# EAGLE design RAMPS_1-2c (EAGLE 5.11)
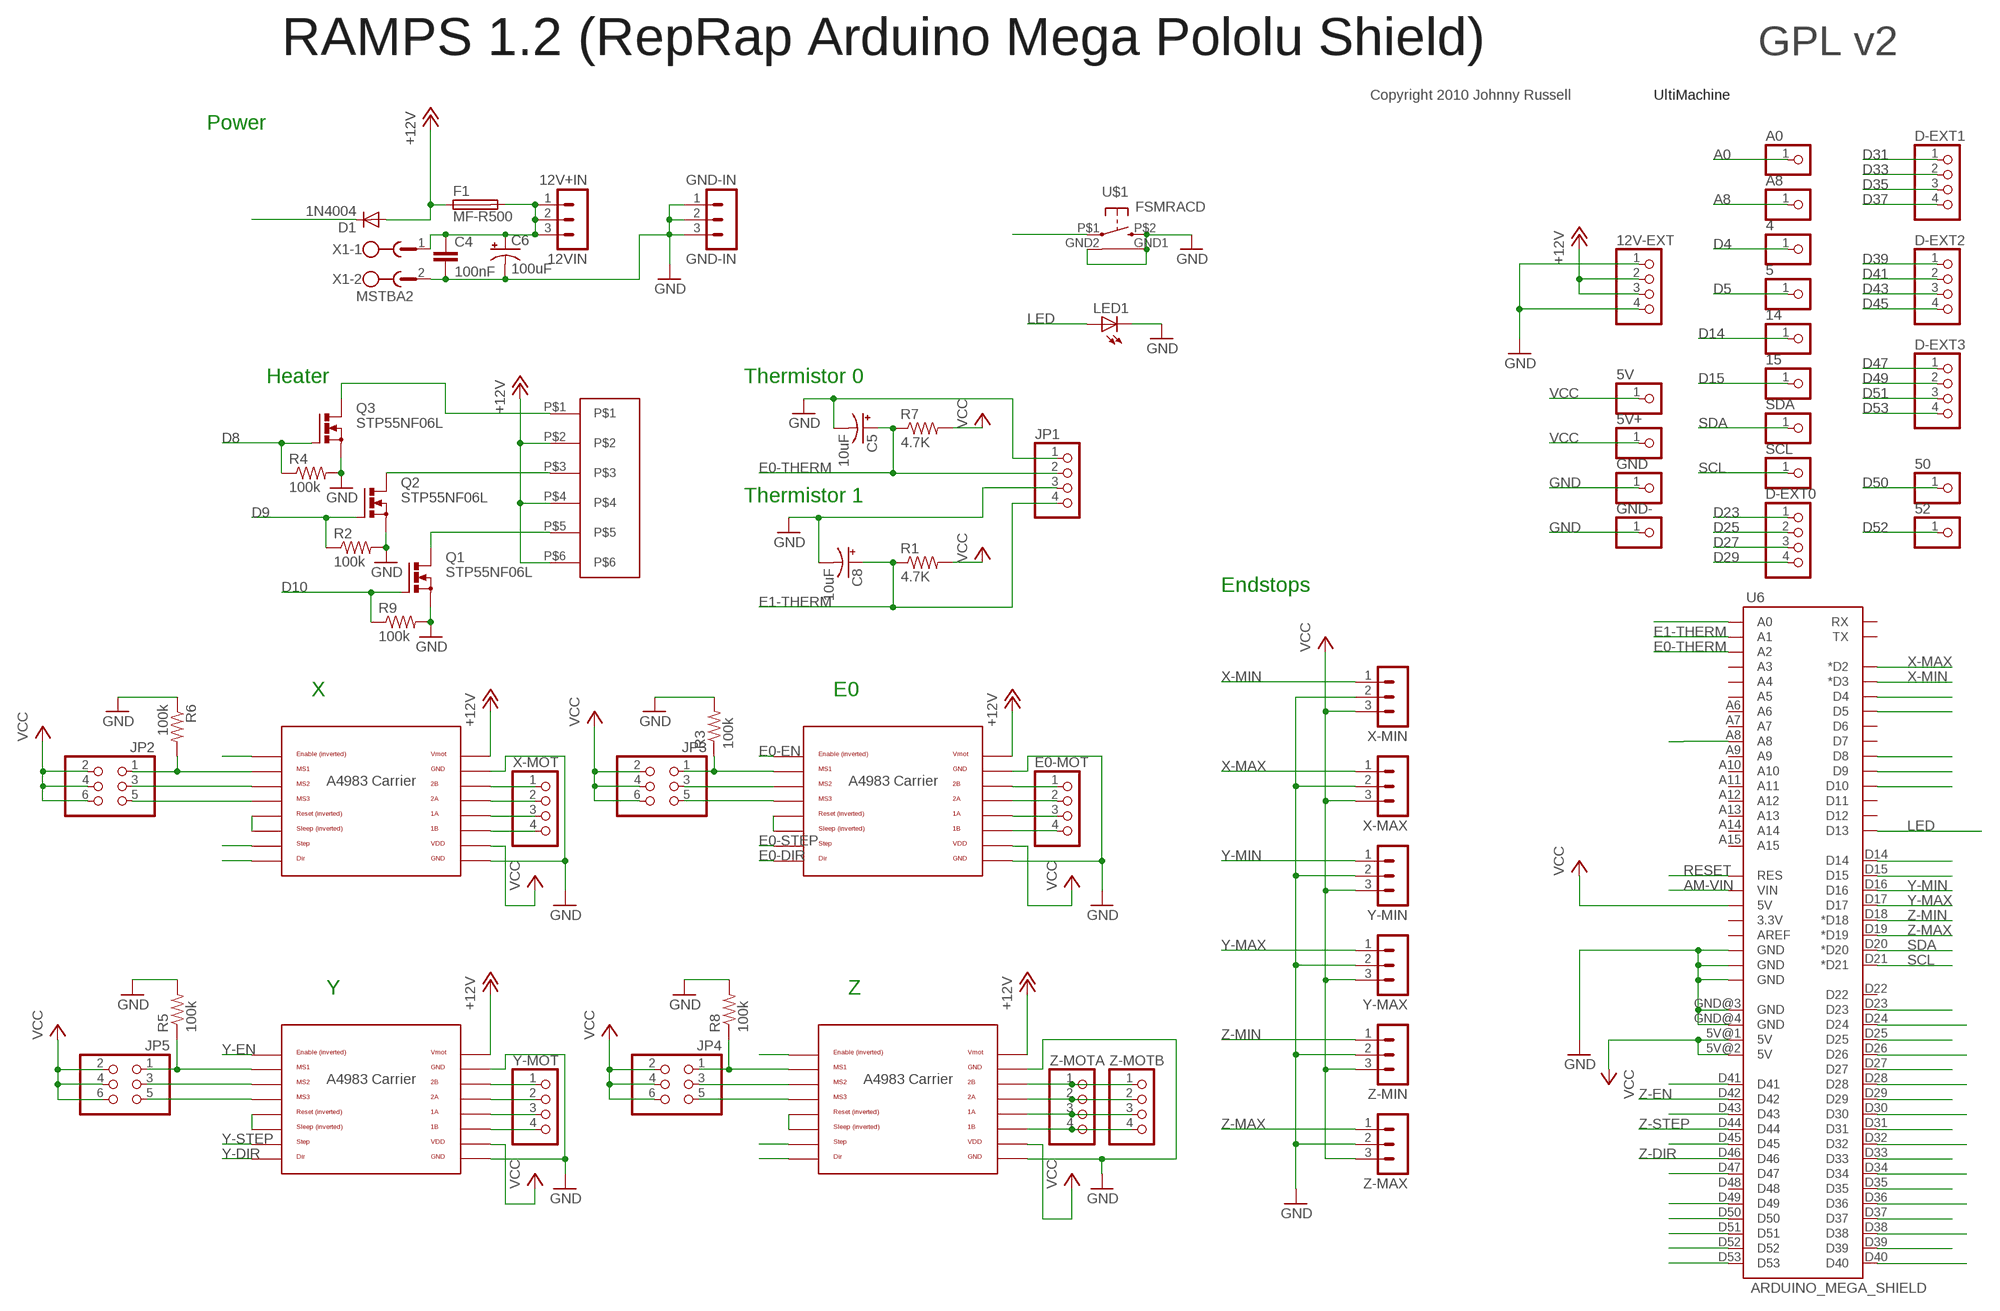
[diagram p0: schematic, sheet 1]

## Parts
4  PINHD-1X1  [1X01]
5  PINHD-1X1  [1X01]
5V  PINHD-1X1  [1X01]
5V+  PINHD-1X1  [1X01]
12V-EXT  PINHD-1X4  [1X04]
12VIN  12V+IN  3PIN-HEADER  [3PIN-HEADER]
14  PINHD-1X1  [1X01]
15  PINHD-1X1  [1X01]
50  PINHD-1X1  [1X01]
52  PINHD-1X1  [1X01]
A0  PINHD-1X1  [1X01]
A8  PINHD-1X1  [1X01]
C4  100nF  C2,5-3  [C2.5-3]
C5  10uF  CPOL-USE2.5-5  [E2,5-5]
C6  100uF  CPOL-USE2.5-5  [E2,5-5]
C8  10uF  CPOL-USE2.5-5  [E2,5-5]
D1  1N4004  [DO41-10]
D-EXT0  PINHD-1X4  [1X04]
D-EXT1  PINHD-1X4  [1X04]
D-EXT2  PINHD-1X4  [1X04]
D-EXT3  PINHD-1X4  [1X04]
E0-MOT  PINHD-1X4  [1X04]
F1  MF-R500  LITTLEFUSE  [LITTLEFUSE]
GND  PINHD-1X1  [1X01]
GND-  PINHD-1X1  [1X01]
GND-IN  GND-IN  3PIN-HEADER  [3PIN-HEADER]
JP1  PINHD-1X4  [1X04]
JP2  PINHD-2X3  [2X03]
JP3  PINHD-2X3  [2X03]
JP4  PINHD-2X3  [2X03]
JP5  PINHD-2X3  [2X03]
LED1  LED3MM  [LED3MM]
Q1  STP55NF06L  IRF512  [TO220BV]
Q2  STP55NF06L  IRF512  [TO220BV]
Q3  STP55NF06L  IRF512  [TO220BV]
R1  4.7K  R-US_0207/7  [0207/7]
R2  100k  R-US_0207/7  [0207/7]
R3  100k  R-US_0207/7  [0207/7]
R4  100k  R-US_0207/7  [0207/7]
R5  100k  R-US_0207/7  [0207/7]
R6  100k  R-US_0411/3V  [0411V]
R7  4.7K  R-US_0207/7  [0207/7]
R8  100k  R-US_0207/7  [0207/7]
R9  100k  R-US_0207/7  [0207/7]
SCL  PINHD-1X1  [1X01]
SDA  PINHD-1X1  [1X01]
U2  POLOLU_A4983CARRIER  [A4983CARRIER]
U3  POLOLU_A4983CARRIER  [A4983CARRIER]
U4  POLOLU_A4983CARRIER  [A4983CARRIER]
U5  POLOLU_A4983CARRIER  [A4983CARRIER]
U6  ARDUINO_MEGA_SHIELD  [ARDUINO_MEGA_SHIELD]
U$1  FSMRACD  [FSMRACD]
U$2  282837-6  [282837-6]
X1  MSTBA2  [MSTBA2]
X-MAX  3PIN-HEADER  [3PIN-HEADER]
X-MIN  3PIN-HEADER  [3PIN-HEADER]
X-MOT  PINHD-1X4  [1X04]
Y-MAX  3PIN-HEADER  [3PIN-HEADER]
Y-MIN  3PIN-HEADER  [3PIN-HEADER]
Y-MOT  PINHD-1X4  [1X04]
Z-MAX  3PIN-HEADER  [3PIN-HEADER]
Z-MIN  3PIN-HEADER  [3PIN-HEADER]
Z-MOTA  PINHD-1X4  [1X04]
Z-MOTB  PINHD-1X4  [1X04]

## Nets
+12V: 12V-EXT.2 12V-EXT.3 D1.A F1.1 U2.VMOT U3.VMOT U4.VMOT U5.VMOT U$2.P$2 U$2.P$4 U$2.P$6
A0: A0.1 U6.A0
A8: A8.1 U6.A8
AM-VIN: D1.C U6.VIN
D4: 4.1 U6.D4
D5: 5.1 U6.D5
D8: Q3.G R4.1 U6.D8
D9: Q2.G R2.1 U6.D9
D10: Q1.G R9.1 U6.D10
D14: 14.1 U6.D14
D15: 15.1 U6.D15
D23: D-EXT0.1 U6.D23
D25: D-EXT0.2 U6.D25
D27: D-EXT0.3 U6.D27
D29: D-EXT0.4 U6.D29
D31: D-EXT1.1 U6.D31
D33: D-EXT1.2 U6.D33
D35: D-EXT1.3 U6.D35
D37: D-EXT1.4 U6.D37
D39: D-EXT2.1 U6.D39
D41: D-EXT2.2 U6.D41
D43: D-EXT2.3 U6.D43
D45: D-EXT2.4 U6.D45
D47: D-EXT3.1 U6.D47
D49: D-EXT3.2 U6.D49
D50: 50.1 U6.D50
D51: D-EXT3.3 U6.D51
D52: 52.1 U6.D52
D53: D-EXT3.4 U6.D53
E0-DIR: U5.DIR U6.D34
E0-EN: U5.EN U6.D30
E0-STEP: U5.STEP U6.D32
E0-THERM: C5.+ JP1.2 R7.1 U6.A2
E1-THERM: C8.+ JP1.4 R1.1 U6.A1
GND: 12V-EXT.1 12V-EXT.4 C4.2 C5.- C6.- C8.- GND-.1 GND-IN.1 GND-IN.2 GND-IN.3 GND.1 JP1.1 JP1.3 LED1.K(C) Q1.S Q2.S Q3.S R2.2 R3.2 R4.2 R5.2 R6.1 R8.2 R9.2 U2.GND U2.GND@0(GND) U3.GND U3.GND@0(GND) U4.GND U4.GND@0(GND) U5.GND U5.GND@0(GND) U6.GND@0(GND) U6.GND@1(GND) U6.GND@2(GND) U6.GND@3(GND) U6.GND@4(GND) U$1.GND1 U$1.GND2 U$1.P$2(S) X1.2 X-MAX.2 X-MIN.2 Y-MAX.2 Y-MIN.2 Z-MAX.2 Z-MIN.2
LED: LED1.A U6.D13
N$1: Q1.D U$2.P$5
N$2: Q2.D U$2.P$3
N$3: U2.2B X-MOT.1
N$4: U2.2A X-MOT.2
N$5: JP2.1 R6.2 U2.MS1
N$6: JP2.3 U2.MS2
N$7: Q3.D U$2.P$1
N$8: U2.RST U2.SLP(SLEEP)
N$9: JP2.5 U2.MS3
N$10: U2.1A X-MOT.3
N$11: U2.1B X-MOT.4
N$12: U5.RST U5.SLP(SLEEP)
N$13: JP3.5 U5.MS3
N$14: JP4.1 R8.1 U4.MS1
N$15: JP5.1 R5.1 U3.MS1
N$16: JP3.3 U5.MS2
N$17: JP4.3 U4.MS2
N$18: JP3.1 R3.1 U5.MS1
N$19: JP5.3 U3.MS2
N$20: JP5.5 U3.MS3
N$21: U3.RST U3.SLP(SLEEP)
N$22: U3.2B Y-MOT.1
N$23: JP4.5 U4.MS3
N$24: E0-MOT.1 U5.2B
N$25: E0-MOT.2 U5.2A
N$26: U3.2A Y-MOT.2
N$27: U3.1A Y-MOT.3
N$28: U4.2B Z-MOTA.1 Z-MOTB.1
N$29: U4.2A Z-MOTA.2 Z-MOTB.2
N$30: U4.1A Z-MOTA.3 Z-MOTB.3
N$31: U4.RST U4.SLP(SLEEP)
N$32: E0-MOT.3 U5.1A
N$33: U4.1B Z-MOTA.4 Z-MOTB.4
N$34: E0-MOT.4 U5.1B
N$35: U3.1B Y-MOT.4
N$37: 12VIN.1 12VIN.2 12VIN.3 C4.1 C6.+ F1.2 X1.1
RESET: U6.RES U$1.P$1(P)
SCL: SCL.1 U6.D21(*D21)
SDA: SDA.1 U6.D20(*D20)
VCC: 5V+.1 5V.1 JP2.2 JP2.4 JP2.6 JP3.2 JP3.4 JP3.6 JP4.2 JP4.4 JP4.6 JP5.2 JP5.4 JP5.6 R1.2 R7.2 U2.VDD U3.VDD U4.VDD U5.VDD U6.5V@0(5V) U6.5V@1(5V) U6.5V@2(5V) X-MAX.3 X-MIN.3 Y-MAX.3 Y-MIN.3 Z-MAX.3 Z-MIN.3
X-DIR: U2.DIR U6.D28
X-EN: U2.EN U6.D24
X-MAX: U6.D2(*D2) X-MAX.1
X-MIN: U6.D3(*D3) X-MIN.1
X-STEP: U2.STEP U6.D26
Y-DIR: U3.DIR U6.D40
Y-EN: U3.EN U6.D36
Y-MAX: U6.D17 Y-MAX.1
Y-MIN: U6.D16 Y-MIN.1
Y-STEP: U3.STEP U6.D38
Z-DIR: U4.DIR U6.D46
Z-EN: U4.EN U6.D42
Z-MAX: U6.D19(*D19) Z-MAX.1
Z-MIN: U6.D18(*D18) Z-MIN.1
Z-STEP: U4.STEP U6.D44
Unconnected: U6.3.3V U6.A3 U6.A4 U6.A5 U6.A6 U6.A7 U6.A9 U6.A10 U6.A11 U6.A12 U6.A13 U6.A14 U6.A15 U6.AREF U6.D6 U6.D7 U6.D11 U6.D12 U6.D22 U6.D48 U6.RX U6.TX

## Notes on the sheet
- RAMPS 1.2 (RepRap Arduino Mega Pololu Shield) | GPL v2
- Copyright 2010 Johnny Russell | UltiMachine
- Power
- Heater | Thermistor 0
- Thermistor 1
- Endstops
- X | E0
- Y | Z

## Library data of the parts
4 5 5V 5V+ 14 15 50 52 A0 A8 GND GND- SCL SDA = adafruit:PINHD-1X1: Pin header 1x1 for 0.1" spacing With round pins
12V-EXT D-EXT0 D-EXT1-D-EXT3 E0-MOT JP1 X-MOT Y-MOT Z-MOTA Z-MOTB = RepRapjr:PINHD-1X4: PIN HEADER
12VIN GND-IN X-MAX X-MIN Y-MAX Y-MIN Z-MAX Z-MIN = ultimachine:3PIN-HEADER: PIN HEADER
C4 = capacitor-wima:C: CAPACITOR naming: grid - package width
C5 C6 C8 = adafruit:CPOL-US: POLARIZED CAPACITOR, American symbol
D1 = diode:1N4004: DIODE general purpose rectifier, 1 A
F1 = fuse:LITTLEFUSE: LITTLEFUSE Picofuse/slow Littlefuse
JP2-JP5 = pinhead:PINHD-2X3: PIN HEADER
LED1 = led:LED: LED OSRAM: - CHIPLED LG R971, LG N971, LY N971, LG Q971, LY Q971, LO R971, LY R971 LH N974, LH R974 LS Q976, LO Q976, LY Q976 LO Q996 - Hyper CHIPLED LW Q18S LB Q993, LB Q99A, LB R99A - SideLED LS A670, LO A670, LY A670, LG A670, LP A670 LB A673, LV A673, LT A673, LW A673 LH A674 LY A675 LS A676, LA A676, LO A676, LY A676, LW A676 LS A679, LY A679, LG A679 - Hyper Micro SIDELED® LS Y876, LA Y876, LO Y876, LY Y876 LT Y87S - SmartLED LW L88C, LW L88S LB L89C, LB L89S, LG L890 LS L89K, LO L89K, LY L89K LS L896, LA L896, LO L896, LY L896 - TOPLED LS T670, LO T670, LY T670, LG T670, LP T670 LSG T670, LSP T670, LSY T670, LOP T670, LYG T670 LG T671, LOG T671, LSG T671 LB T673, LV T673, LT T673, LW T673 LH T674 LS T676, LA T676, LO T676, LY T676, LB T676, LH T676, LSB T676, LW T676 LB T67C, LV T67C, LT T67C, LS T67K, LO T67K, LY T67K, LW E67C LS E67B, LA E67B, LO E67B, LY E67B, LB E67C, LV E67C, LT E67C LW T67C LS T679, LY T679, LG T679 LS T770, LO T770, LY T770, LG T770, LP T770 LB T773, LV T773, LT T773, LW T773 LH T774 LS E675, LA E675, LY E675, LS T675 LS T776, LA T776, LO T776, LY T776, LB T776 LHGB T686 LT T68C, LB T68C - Hyper Mini TOPLED® LB M676 - Mini TOPLED Santana® LG M470 LS M47K, LO M47K, LY M47K Source: http://www.osram.convergy.de LUXEON: - LUMILED® LXK2-PW12-R00, LXK2-PW12-S00, LXK2-PW14-U00, LXK2-PW14-V00 LXK2-PM12-R00, LXK2-PM12-S00, LXK2-PM14-U00 LXK2-PE12-Q00, LXK2-PE12-R00, LXK2-PE12-S00, LXK2-PE14-T00, LXK2-PE14-U00 LXK2-PB12-K00, LXK2-PB12-L00, LXK2-PB12-M00, LXK2-PB14-N00, LXK2-PB14-P00, LXK2-PB14-Q00 LXK2-PR12-L00, LXK2-PR12-M00, LXK2-PR14-Q00, LXK2-PR14-R00 LXK2-PD12-Q00, LXK2-PD12-R00, LXK2-PD12-S00 LXK2-PH12-R00, LXK2-PH12-S00 LXK2-PL12-P00, LXK2-PL12-Q00, LXK2-PL12-R00 Source: www.luxeon.com KINGBRIGHT: KA-3528ASYC Source: www.kingbright.com
Q1-Q3 = transistor-power:IRF512: N-CHANNEL MOS FET
R1-R9 = adafruit:R-US_: RESISTOR, American symbol
U2-U5 = ultimachine:POLOLU_A4983CARRIER
U6 = RepRapjr:ARDUINO_MEGA_SHIELD
U$1 = RepRapjr:FSMRACD
U$2 = RepRapjr:282837-6
X1 = con-phoenix-508:MSTBA2: PHOENIX

## Board
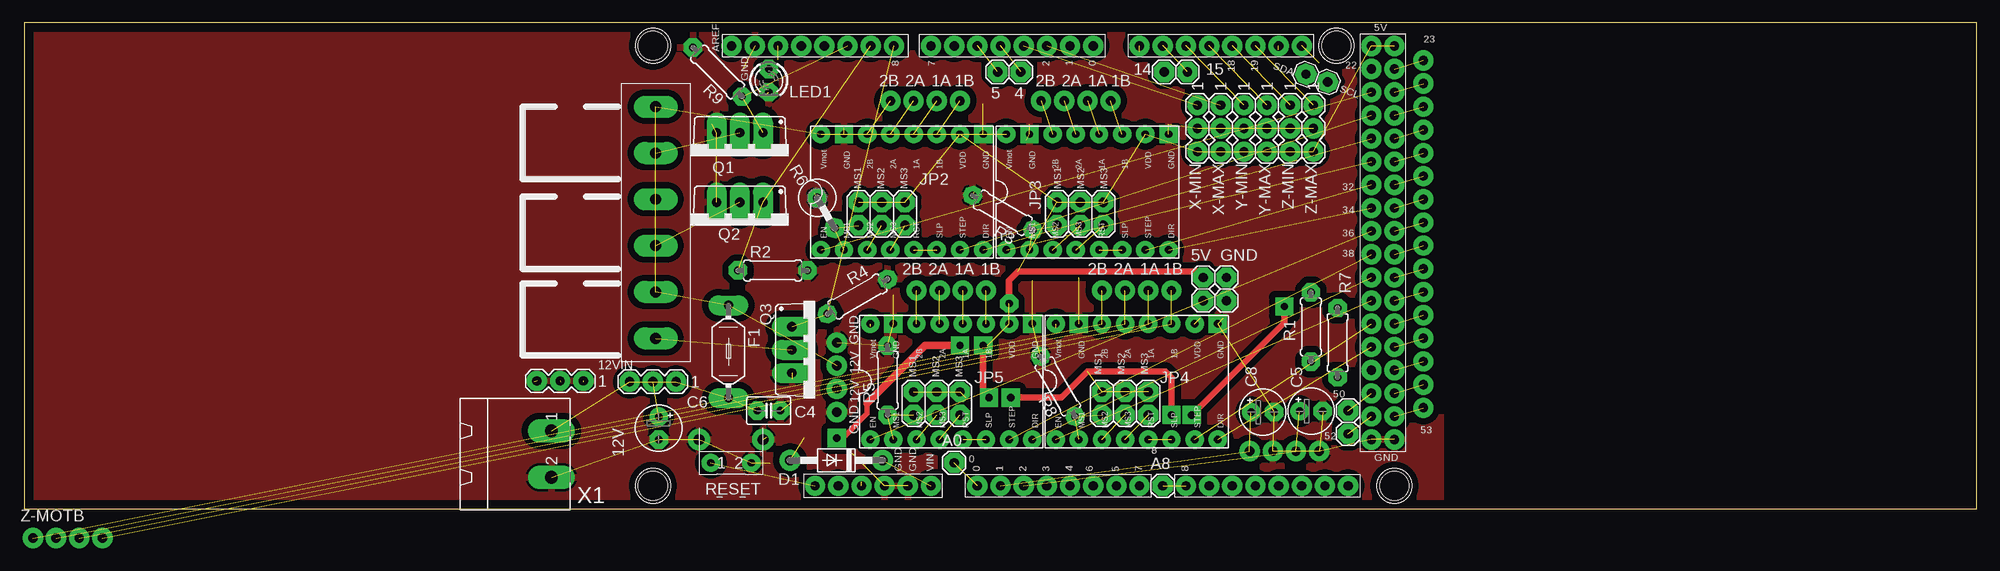
[diagram p1: board, top side]
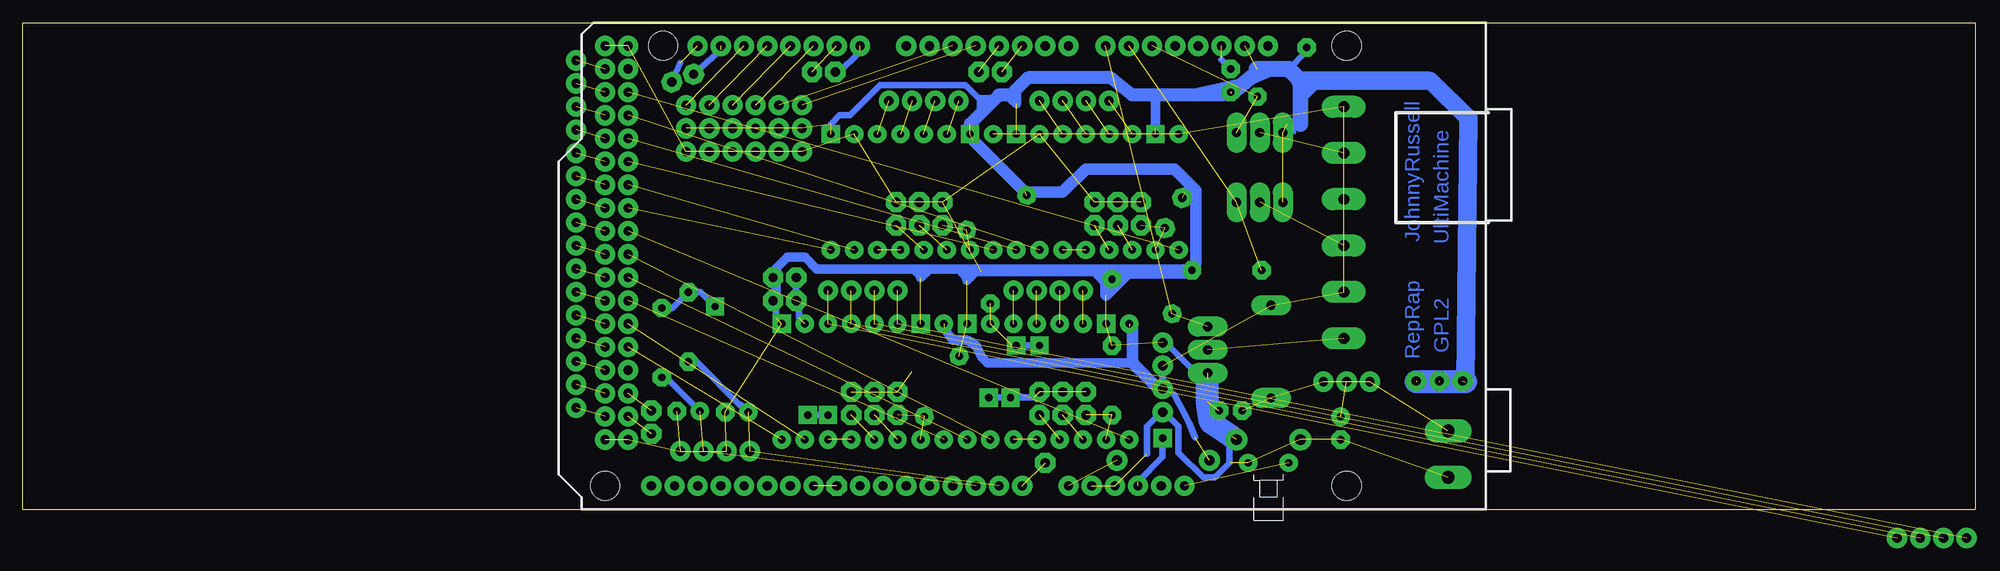
[diagram p2: board, bottom side, seen from below]

Size 213.98 x 53.33 mm. Coordinates in mm from the lower left corner, seen from the top.
Outline: 213.98,0 213.98,53.33 0,53.33 0,0 213.98,0
Copper layers (1*16): Top 0.035mm / dielectric 1.5mm / Bottom 0.035mm
Design rules "reprapprintable": minimum track width 0.7mm, minimum drill 0.8mm, track to track 0.7mm, track to pad 0.32mm, pad to pad 0.32mm, via to via 0.45mm, smd to smd 8mil, copper to edge 40mil, drill to drill 8mil, minimum pad ring 0.6mm, minimum via ring 0.6mm, stop-mask expansion 4mil, vias tented up to drill 0mil, thermal gap 10mil

### Footprints (pad centres in the part's own frame; a part is rotated, then mirrored left to right if it is on the bottom)
1X01 = drill 1.016 pad 1.93 octagon: 1 0,0
1X04 = drill 1.016 round: 1 -2.54,0; 2 0,0; 3 2.54,0; 4 5.08,0
3PIN-HEADER = drill 1.016 round: 1 -2.54,0; 2 0,0; 3 2.54,0
C2.5-3 = drill 0.813 pad 1.6 octagon: 1 -1.27,0; 2 1.27,0
E2,5-5 = drill 0.813 pad 1.6 round: + -1.27,0 | drill 0.813 pad 1.6 octagon: - 1.27,0
DO41-10 = drill 1.118 round: A 5.08,0; C -5.08,0
LITTLEFUSE = drill 1 pad 1.778 long: 1 -5.08,0; 2 5.08,0
2X03 = drill 1.016 octagon: 1 -2.54,-1.27; 2 -2.54,1.27; 3 0,-1.27; 4 0,1.27; 5 2.54,-1.27; 6 2.54,1.27
LED3MM = drill 0.813 octagon: A -1.27,0; K 1.27,0
TO220BV = drill 1.016 long: D 0,-2.54; G -2.54,-2.54; S 2.54,-2.54
0207/7 = drill 0.813 octagon: 1 -3.81,0; 2 3.81,0
0411V = drill 0.914 octagon: 1 -2.54,0; 2 1.27,0
A4983CARRIER = drill 0.813 round: 1A 8.89,1.27; 1B 11.43,1.27; 2A 6.35,1.27; 2B 3.81,1.27; DIR 16.51,-11.43; EN -1.27,-11.43; MS1 1.27,-11.43; MS2 3.81,-11.43; MS3 6.35,-11.43; RST 8.89,-11.43; SLP 11.43,-11.43; STEP 13.97,-11.43; VDD 13.97,1.27; VMOT -1.27,1.27 | drill 0.813 square: GND 16.51,1.27; GND@0 1.27,1.27
ARDUINO_MEGA_SHIELD = drill 1.016 pad 1.88 round: 3.3V 50.8,26.67; 5V@0 50.8,29.21; 5V@1 2.54,85.09; 5V@2 2.54,87.63; A0 50.8,41.91; A1 50.8,44.45; A2 50.8,46.99; A3 50.8,49.53; A4 50.8,52.07; A5 50.8,54.61; A6 50.8,57.15; A7 50.8,59.69; A8 50.8,64.77; A9 50.8,67.31; A10 50.8,69.85; A11 50.8,72.39; A12 50.8,74.93; A13 50.8,77.47; A14 50.8,80.01; A15 50.8,82.55; AREF 2.54,14.986; D2 2.54,49.53; D3 2.54,46.99; D4 2.54,44.45; D5 2.54,41.91; D6 2.54,39.37; D7 2.54,36.83; D8 2.54,32.766; D9 2.54,30.226; D10 2.54,27.686; D11 2.54,25.146; D12 2.54,22.606; D13 2.54,20.066; D14 2.54,59.69; D15 2.54,62.23; D16 2.54,64.77; D17 2.54,67.31; D18 2.54,69.85; D19 2.54,72.39; D20 2.54,74.93; D21 2.54,77.47; D22 5.08,85.09; D23 5.08,87.63; D24 7.62,85.09; D25 7.62,87.63; D26 10.16,85.09; D27 10.16,87.63; D28 12.7,85.09; D29 12.7,87.63; D30 15.24,85.09; D31 15.24,87.63; D32 17.78,85.09; D33 17.78,87.63; D34 20.32,85.09; D35 20.32,87.63; D36 22.86,85.09; D37 22.86,87.63; D38 25.4,85.09; D39 25.4,87.63; D40 27.94,85.09; D41 27.94,87.63; D42 30.48,85.09; D43 30.48,87.63; D44 33.02,85.09; D45 33.02,87.63; D46 35.56,85.09; D47 35.56,87.63; D48 38.1,85.09; D49 38.1,87.63; D50 40.64,85.09; D51 40.64,87.63; D52 43.18,85.09; D53 43.18,87.63; GND@0 50.8,31.75; GND@1 50.8,34.29; GND@2 2.54,17.526; GND@3 45.72,85.09; GND@4 45.72,87.63; RES 50.8,24.13; RX 2.54,54.61; TX 2.54,52.07; VIN 50.8,36.83 | hole 3.2: 2.54,6.35; 2.54,81.28; 50.8,87.63; 50.8,6.35
FSMRACD = drill 1.2 round: GND1 0,3.81; GND2 6.985,3.81 | drill 0.8 round: P$1 1.27,1.27; P$2 5.715,1.27
282837-6 = drill 1.2 long: P$1 0,-12.7; P$2 0,-7.62; P$3 0,-2.54; P$4 0,2.54; P$5 0,7.62; P$6 0,12.7
MSTBA2 = drill 1.397 long: 1 -2.54,5.08; 2 2.54,5.08

### Placement (x,y rotation side)
4  109.22,47.94 0 top
5  106.68,47.94 0 top
5V  129.22,25.4 0 top
5V+  129.22,22.86 0 top
12V-EXT  89.06,13.18 90 top
12VIN  68.9,13.97 180 top
14  124.94,47.94 0 top
15  127.48,47.94 0 top
50  145.1,10.79 0 top
52  145.1,8.26 0 top
A0  101.92,5.08 0 top
A8  124.78,2.54 0 top
C4  81.6,10.79 0 top
C5  141.05,10.74 0 top
C6  69.53,8.89 270 top
C8  135.73,10.64 0 top
D1  89,5.36 180 top
D-EXT0  153.35,46.67 270 top
D-EXT1  153.35,36.51 270 top
D-EXT2  153.35,26.35 270 top
D-EXT3  153.35,16.19 270 top
E0-MOT  113.98,44.77 0 top
F1  77.18,17.27 270 top
GND  131.76,25.4 0 top
GND-  131.76,22.86 0 top
GND-IN  58.73,14.05 180 top
JP1  139.38,6.35 180 top
JP2  93.98,32.38 0 top
JP3  115.73,32.38 0 top
JP4  120.65,11.59 0 top
JP5  100.01,11.59 0 top
LED1  81.6,46.99 270 top
Q1  78.42,38.73 180 top
Q2  78.42,31.11 180 top
Q3  86.68,17.46 270 top
R1  141.02,19.99 90 top
R2  82.03,26.18 0 top
R3  107.24,32.5 150 top
R4  91.32,23.32 30 top
R5  94.62,14.13 90 top
R6  88.18,31.92 300 top
R7  143.94,18.25 90 top
R8  113.27,13.46 120 top
R9  75.98,47.93 135 top
SCL  142.86,46.84 340 top
SDA  140.47,47.7 340 top
U2  88.58,39.85 0 top
U3  93.98,19.05 0 top
U4  114.3,19.05 0 top
U5  108.9,39.85 0 top
U6  62.55,53.34 270 top
U$1  73.98,3.81 0 top
U$2  69.22,31.43 0 top
X1  52.7,6.03 270 top
X-MAX  131.13,41.75 270 top
X-MIN  128.59,41.75 270 top
X-MOT  97.47,44.77 0 top
Y-MAX  136.21,41.75 270 top
Y-MIN  133.67,41.75 270 top
Y-MOT  100.33,23.97 0 top
Z-MAX  141.29,41.75 270 top
Z-MIN  138.75,41.75 270 top
Z-MOTA  120.65,23.97 0 top
Z-MOTB  3.49,-3.18 0 top  (outside the outline)

### Tracks (layer width: path | path; a pad name or v marks a point on that pad's centre or on a via)
+12V  (9 unrouted)
  Bottom 0.7: 12V-EXT.2 | 12V-EXT.2 89.06,13.33 | 89.06,13.33 | 89.06,13.33 12V-EXT.3 | 89.06,13.33 89.69,13.33 | 85.51,7.88 86.2,9.53 87.79,12.54 88.74,13.18 12V-EXT.2
  Bottom 1.016: 113.03,19.84 112.08,18.57 110.49,18.57 109.54,17.94 108.9,16.67 108.27,16.03 92.39,16.03 92.07,16.03
  Bottom 1.27: 92.71,20 92.39,19.68 92.39,16.03 89.69,13.33
A0  (1 unrouted)
A8  (1 unrouted)
AM-VIN  (1 unrouted)
D4  (1 unrouted)
D5  (1 unrouted)
D8  (2 unrouted)
D9  (2 unrouted)
D10  (2 unrouted)
D14  (1 unrouted)
  Bottom 0.7: 122.24,50.16 124.62,47.78 14.1
D15  (1 unrouted)
D23  (1 unrouted)
D25  (1 unrouted)
D27  (1 unrouted)
D29  (1 unrouted)
D31  (1 unrouted)
D33  (1 unrouted)
D35  (1 unrouted)
D37  (1 unrouted)
D39  (1 unrouted)
D41  (1 unrouted)
D43  (1 unrouted)
D45  (1 unrouted)
D47  (1 unrouted)
D49  (1 unrouted)
D50  (1 unrouted)
  Bottom 0.7: 50.1 145.1,10.16
D51  (1 unrouted)
D52  (1 unrouted)
  Bottom 0.7: 52.1 145.1,7.62
D53  (1 unrouted)
E0-DIR  (1 unrouted)
E0-EN  (1 unrouted)
E0-STEP  (1 unrouted)
E0-THERM  (2 unrouted)
  Bottom 0.7: 139.62,11.07 C5.+ 143.48,14.44 R7.1
E1-THERM  (2 unrouted)
  Bottom 0.7: 134.78,10.64 C8.+ 135.26,11.43 135.41,11.43 140.16,16.18 R1.1
GND  (42 unrouted)
  Bottom 0.406: 74.61,41.27 74.61,42.23 75.41,42.23 | 73.98,46.99 73.02,46.99
  Bottom 0.7: 80.49,46.18 81.76,45.56 LED1.K 80.3,47.01 80.94,46.48 | 104.14,34.77 104.77,35.24 | R9.2 73.28,50.22 75.25,48.26 75.25,48.05 75.23,48.03 | 90.81,6.03 90.81,9.05 89.53,10.32 89.06,10.32 88.9,10.48 89.22,10.48 | 81.43,7.9 81.76,7.57 81.76,5.08 83.34,3.49 84.61,3.49 | 84.61,3.49 87.31,6.19 87.31,9.05 88.9,10.64 12V-EXT.1 89.22,10.48 | 84.61,3.49 | 109.22,45.09 110.65,46.51 120.02,46.51 123.35,43.18 124.46,43.18 125.41,42.23 | 89.22,10.48 | 12V-EXT.4 88.9,18.1 88.27,18.1 88.27,17.78 84.77,14.29 84.14,14.29 | GND.1 131.29,25.88 | GND-.1 131.44,22.86 131.44,20.95 | 109.22,45.09 107,45.09 106.68,45.4 | 109.06,44.93 108.59,44.29 | 109.06,44.93 109.06,43.81 | 109.22,45.09 109.06,44.93
  Bottom 0.813: 75.23,48.03 75.41,47.71
  Bottom 1.016: 89.85,45.4 89.85,41.75 | 79.06,47.94 80.94,46.48 82.55,45.4 | 110.17,25.4 109.54,26.03 93.5,26.03 93.35,25.88 | 95.25,24.77 96.2,25.72 | 131.44,22.86 131.44,25.72 131.29,25.88 | 114.62,26.35 86.04,26.35 85.41,26.99 | 114.62,26.35 116.36,26.35 | 116.36,26.35 127,26.35 128.27,27.62 130.17,27.62 131.76,26.03 GND.1 | 114.62,26.35 115.57,25.4 115.57,25.56 116.36,26.35 | 110.49,25.4 110.49,25.72 110.17,26.03 110.17,25.4 | 110.17,25.4 110.49,25.08 110.49,25.4 | 110.49,25.4 111.13,26.03 | 105.09,44.61 105.57,45.09 105.73,45.09 105.09,44.45 105.09,44.61 | 105.09,46.04 105.09,44.61
  Bottom 1.27: 78.74,48.26 80.49,46.18 81.6,45.4 82.55,45.4 | 59.37,13.97 58.81,13.97 | 109.85,40.48 104.14,34.77 100.01,34.77 97.47,37.31 87.79,37.31 85.73,35.24 | 73.98,42.23 74.61,42.23 | 93.03,25.72 95.25,23.49 95.25,24.77 94.14,25.88 93.35,25.88 R4.2 93.52,25.22 92.87,25.88 86.17,25.88 R2.2 85.41,26.99 85.41,34.92 85.73,35.24 | 86.63,34.63 86.34,34.63 85.73,35.24 | 73.98,45.09 72.39,46.67
  Bottom 1.422: 82.55,45.4 85.73,45.4 | 85.73,45.4 89.85,45.4 92.39,45.4 94.77,47.31 103.82,47.31 105.09,46.04 105.73,45.4 106.68,45.4 107,45.4 110.17,42.23 | 85.73,45.4 80.01,46.67 | 76.99,48.26 79.85,46.99 | 81.44,45.56 77.79,48.42
  Bottom 1.676: 73.98,46.99 73.98,45.09 73.98,42.23
  Bottom 1.778: 78.74,48.26 76.99,48.26 75.25,48.26 73.98,46.99
  Bottom 1.93: 55.56,42.86 59.69,46.99 60.01,46.99
  Bottom 2: 55.88,13.97 55.56,42.86 | 60.01,46.99 73.98,46.99
  Bottom 2.54: 84.14,14.29 84.14,11.75 83.82,9.53 81.43,7.9 | 55.88,13.97 59.37,13.97 61.28,13.97
  pour Top: 0,53.34 155.26,53.34 155.26,0 0,0
LED  (1 unrouted)
  Bottom 0.7: LED1.A 82.61,49.28
N$1  (1 unrouted)
N$2  (1 unrouted)
N$3  (1 unrouted)
N$4  (1 unrouted)
N$5  (2 unrouted)
N$6  (1 unrouted)
N$7  (1 unrouted)
N$8  (1 unrouted)
N$9  (1 unrouted)
N$10  (1 unrouted)
N$11  (1 unrouted)
N$12  (1 unrouted)
N$13  (1 unrouted)
N$14  (2 unrouted)
N$15  (2 unrouted)
N$16  (1 unrouted)
N$17  (1 unrouted)
N$18  (2 unrouted)
N$19  (1 unrouted)
N$20  (1 unrouted)
N$21  (1 unrouted)
N$22  (1 unrouted)
N$23  (1 unrouted)
N$24  (1 unrouted)
N$25  (1 unrouted)
N$26  (1 unrouted)
N$27  (1 unrouted)
N$28  (2 unrouted)
N$29  (2 unrouted)
N$30  (2 unrouted)
N$31  (1 unrouted)
N$32  (1 unrouted)
N$33  (2 unrouted)
N$34  (1 unrouted)
N$35  (1 unrouted)
N$37  (6 unrouted)
RESET  (1 unrouted)
SCL  (1 unrouted)
  Bottom 0.7: SCL.1 141.92,48.9
SDA  (1 unrouted)
  Bottom 0.7: SDA.1 137.48,50.38
VCC  (via drill 0.8)  (26 unrouted)
  Top 0.61: 92.39,11.59 92.39,10.48 89.85,7.94 89.22,7.94 v89.06,7.78
  Top 0.7: v105.73,12.22 105.09,12.54 v105.09,17.94 | v108.11,12.22 113.67,12.22 116.52,15.08 125.1,15.08 125.73,14.45 v125.73,10.32 | v138.11,22.23 138.11,20.48 v127.95,10.32 | 5V.1 128.59,26.03 108.9,26.03 107.95,25.08 v107.95,22.54
  Top 0.813: v102.55,17.94 98.74,17.94 92.39,11.59
  Bottom 0.7: v102.55,17.94 v105.09,17.94 105.57,17.94 | 103.19,12.22 v105.73,12.22 v108.11,12.22 | 91.76,3.02 89.06,5.71 v89.06,7.78 | v125.73,10.32 v127.95,10.32 | R7.2 142.76,22.06 R1.2 139.69,23.8 v138.11,22.23 | 5V.1 5V+.1 128.91,22.54 128.91,20.95
X-DIR  (1 unrouted)
X-EN  (1 unrouted)
X-MAX  (1 unrouted)
X-MIN  (1 unrouted)
X-STEP  (1 unrouted)
Y-DIR  (1 unrouted)
Y-EN  (1 unrouted)
Y-MAX  (1 unrouted)
Y-MIN  (1 unrouted)
Y-STEP  (1 unrouted)
Z-DIR  (1 unrouted)
Z-EN  (1 unrouted)
Z-MAX  (1 unrouted)
Z-MIN  (1 unrouted)
Z-STEP  (1 unrouted)
(copper drawn outside any net)
  shapes: Bottom circle x3

### Text on the board
Bottom: JohnnyRussell | UltiMachine | RepRap | GPL2
tNames: 5V | 23 | AREF | 8 | 7 | 2 | 1 | 0 | 14 | 15 | 22 | 18 | 19 | GND | 2B | 2A | 1A | 1B | 2B | 2A | 1A | 1B | MS1 | MS2 | MS3 | MS1 | MS2 | MS3 | 32 | 34 | 36 | 38 | 2B | 2A | 1A | 1B | 2B | 2A | 1A | 1B | 12V | GND | MS1 | MS2 | MS3 | MS1 | MS2 | MS3 | 12V | 50 | 52 | GND | 53 | 12V | 8 | 0 | GND | GND | GND | VIN | 0 | 1 | 2 | 3 | 4 | 6 | 5 | 7 | 8 | RESET
Document: + | X | E0 | S | - | + | D10 | + | X | E0 | X | Y | Z | D9 | GPL2 | + | Y | Z | D8 | + | Z | Y | + | + | + | + | T1 | T0 | -